# EAGLE schematic WDT (EAGLE 8.2.2)
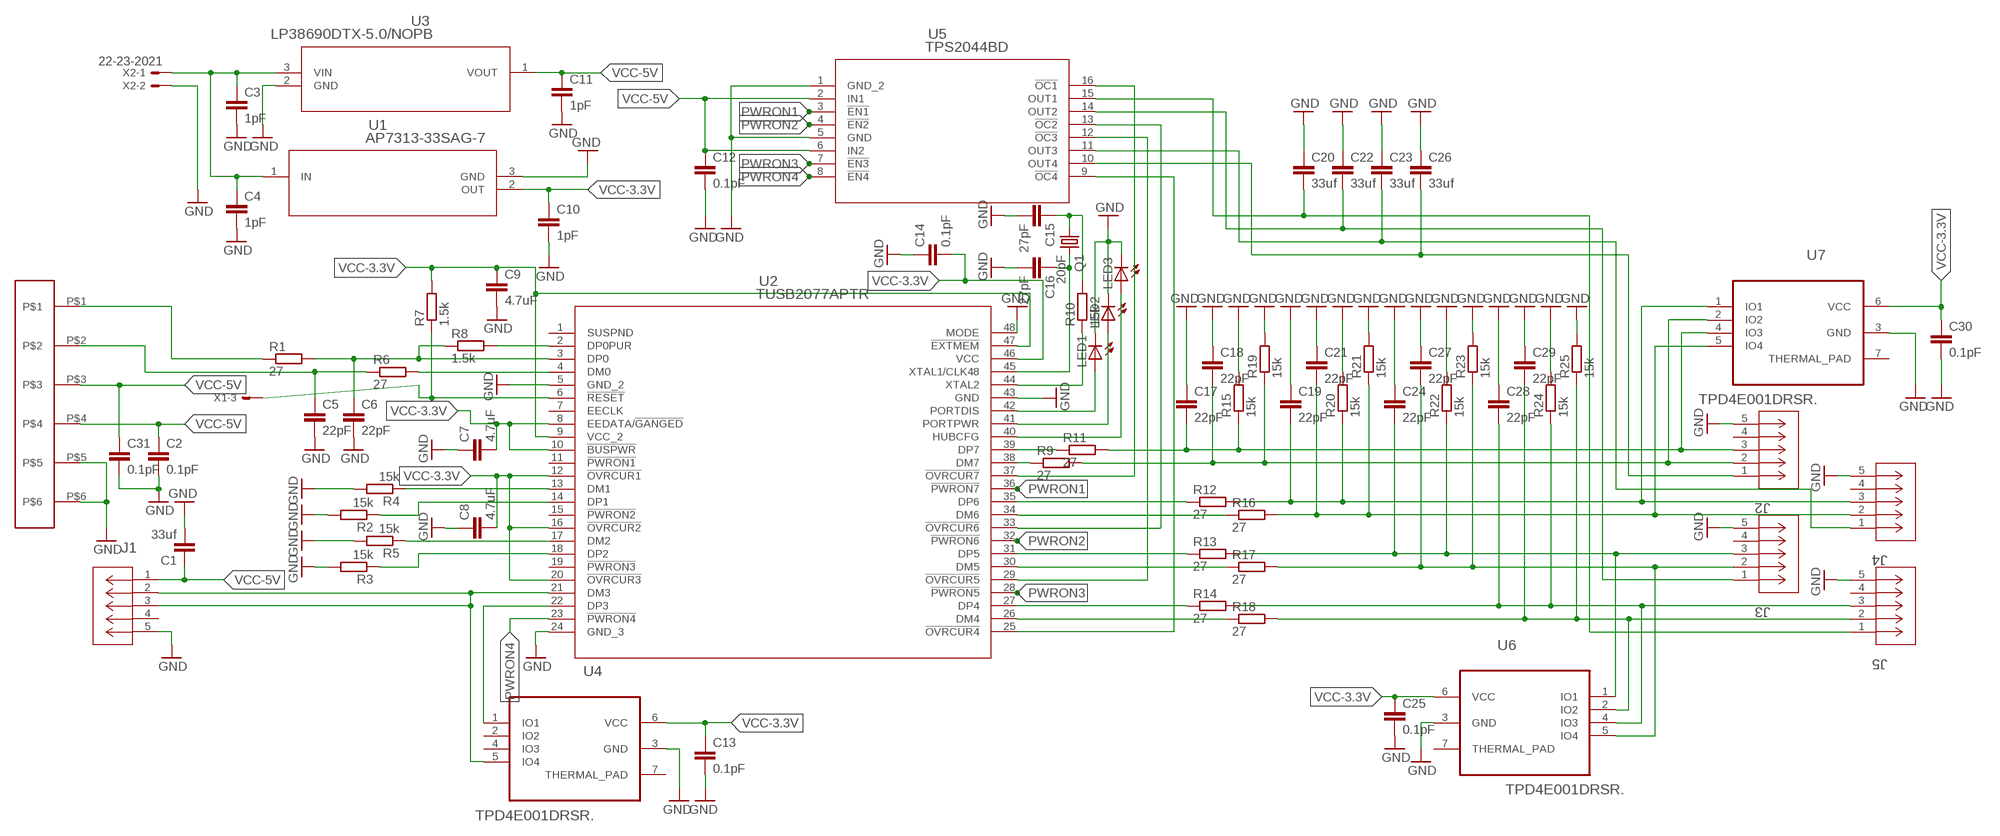
[diagram p0: schematic, sheet 1]

## Parts
C1  33uf  C  [C0805]
C2  0.1pF  C  [C0805]
C3  1pF  C  [C0805]
C4  1pF  C  [C0805]
C5  22pF  C  [C0805]
C6  22pF  C  [C0805]
C7  4.7uF  C  [C0805]
C8  4.7uF  C  [C0805]
C9  4.7uF  C  [C0805]
C10  1pF  C  [C0805]
C11  1pF  C  [C0805]
C12  0.1pF  C  [C0805]
C13  0.1pF  C  [C0805]
C14  0.1pF  C  [C0805]
C15  27pF  C  [C0805]
C16  27pF  C  [C0805]
C17  22pF  C  [C0805]
C18  22pF  C  [C0805]
C19  22pF  C  [C0805]
C20  33uf  C  [C0805]
C21  22pF  C  [C0805]
C22  33uf  C  [C0805]
C23  33uf  C  [C0805]
C24  22pF  C  [C0805]
C25  0.1pF  C  [C0805]
C26  33uf  C  [C0805]
C27  22pF  C  [C0805]
C28  22pF  C  [C0805]
C29  22pF  C  [C0805]
C30  0.1pF  C  [C0805]
C31  0.1pF  C  [C0805]
J1  1981568-1  [CONN_1981568-1]
J2  1981568-1  [CONN_1981568-1]
J3  1981568-1  [CONN_1981568-1]
J4  1981568-1  [CONN_1981568-1]
J5  1981568-1  [CONN_1981568-1]
LED1  LED_E  [LED_1206]
LED2  LED_E  [LED_1206]
LED3  LED_E  [LED_1206]
Q1  20pF  CRYSTALCTS406  [CTS406]
R1  27  R  [R0805]
R2  15k  R  [R0805]
R3  15k  R  [R0805]
R4  15k  R  [R0805]
R5  15k  R  [R0805]
R6  27  R  [R0805]
R7  1.5k  R  [R0805]
R8  1.5k  R  [R0805]
R9  27  R  [R0805]
R10  15k  R  [R0805]
R11  27  R  [R0805]
R12  27  R  [R0805]
R13  27  R  [R0805]
R14  27  R  [R0805]
R15  15k  R  [R0805]
R16  27  R  [R0805]
R17  27  R  [R0805]
R18  27  R  [R0805]
R19  15k  R  [R0805]
R20  15k  R  [R0805]
R21  15k  R  [R0805]
R22  15k  R  [R0805]
R23  15k  R  [R0805]
R24  15k  R  [R0805]
R25  15k  R  [R0805]
U1  AP7313-33SAG-7  [SOT-23]
U2  TUSB2077APTR  [PT48]
U3  LP38690DTX-5.0/NOPB  [TD03B]
U4  TPD4E001DRSR.  [SON95P315X315X80-7N]
U5  TPS2044BD  [D16]
U6  TPD4E001DRSR.  [SON95P315X315X80-7N]
U7  TPD4E001DRSR.  [SON95P315X315X80-7N]
U$1  HEADER-6PIN-50MIL  [PIN-4-1.27MMPITCH]
X1  22-23-2051  [22-23-2051]
X2  22-23-2021  [22-23-2021]

## Nets
GND: C1.2 C2.2 C3.2 C4.2 C5.2 C6.2 C7.1 C8.1 C9.2 C10.2 C11.2 C12.2 C13.2 C14.1 C15.2 C16.2 C17.1 C18.1 C19.1 C20.1 C21.1 C22.1 C23.1 C24.1 C25.2 C26.1 C27.1 C28.1 C29.1 C30.2 C31.2 J1.5 J2.5 J3.5 J4.5 J5.5 LED1.C LED2.C LED3.C R2.2 R3.2 R4.2 R5.2 R15.2 R19.2 R20.2 R21.2 R22.2 R23.2 R24.2 R25.2 U1.3(GND) U2.5(GND_2) U2.24(GND_3) U2.43(GND) U2.48(MODE) U3.2(GND) U4.3(GND) U5.1(GND_2) U5.5(GND) U6.3(GND) U7.3(GND) U$1.P$5 U$1.P$6 X2.2
N27: U2.37(!OVRCUR7) U5.16(!OC1)
N$1: C3.1 C4.1 U1.1(IN) U3.3(VIN) X2.1
N$2: R7.1 U2.6(!RESET) X1.3
N$3: R8.2 U2.2(DP0PUR)
N$4: R10.1 U2.44(XTAL2)
N$5: R5.1 U2.17(DM2)
N$6: C24.2 J3.3 R13.2 R22.1 U6.1(IO1)
N$7: C27.2 J3.2 R17.2 R23.1 U6.5(IO4)
N$8: C22.2 J3.1 U5.14(OUT2)
N$9: LED1.A U2.42(PORTDIS)
N$10: C17.2 J2.3 R11.2 R15.1 U7.4(IO3)
N$11: C18.2 J2.2 R9.2 R19.1 U7.2(IO2)
N$12: C19.2 J4.3 R12.2 R20.1 U7.1(IO1)
N$13: C21.2 J4.2 R16.2 R21.1 U7.5(IO4)
N$14: C28.2 J5.3 R14.2 R24.1 U6.4(IO3)
N$15: C29.2 J5.2 R18.2 R25.1 U6.2(IO2)
N$16: J1.2 J1.3 U2.21(DM3) U4.5(IO4)
N$17: U2.22(DP3) U4.1(IO1)
N$18: R14.1 U2.27(DP4)
N$19: R9.1 U2.38(DM7)
N$20: R11.1 U2.39(DP7)
N$21: C6.1 R1.2 R8.1 U2.3(DP0)
N$22: C5.1 R6.1 U$1.P$2
N$23: C26.2 J2.1 U5.10(OUT4)
N$24: C23.2 J4.1 U5.11(OUT3)
N$25: C20.2 J5.1 U5.15(OUT1)
N$26: R4.1 U2.13(DM1)
N$27: R3.1 U2.18(DP2)
N$28: U2.29(!OVRCUR5) U5.12(!OC3)
N$29: R1.1 U$1.P$1
N$30: U2.33(!OVRCUR6) U5.13(!OC2)
N$31: R6.2 U2.4(DM0)
N$32: R2.1 U2.14(DP1)
N$33: R12.1 U2.35(DP6)
N$34: R17.1 U2.30(DM5)
N$35: U2.25(!OVRCUR4) U5.9(!OC4)
N$36: R13.1 U2.31(DP5)
N$37: R18.1 U2.26(DM4)
N$38: R16.1 U2.34(DM6)
N$39: LED2.A U2.41(PORTPWR)
N$40: LED3.A U2.40(HUBCFG)
N$41: C16.1 Q1.3 U2.45(XTAL1/CLK48)
N$42: C15.1 Q1.1 R10.2
PWRON1: U2.36(!PWRON7) U5.3(!EN1)
PWRON2: U2.32(!PWRON6) U5.4(!EN2)
PWRON3: U2.28(!PWRON5) U5.7(!EN3)
PWRON4: U2.23(!PWRON4) U5.8(!EN4)
VCC-3.3V: C7.2 C8.2 C9.1 C10.1 C13.1 C14.2 C25.1 C30.1 R7.2 U1.2(OUT) U2.8(EEDATA/!GANGED) U2.9(VCC_2) U2.10(!BUSPWR) U2.12(!OVRCUR1) U2.16(!OVRCUR2) U2.20(!OVRCUR3) U2.46(VCC) U2.47(!EXTMEM) U4.6(VCC) U6.6(VCC) U7.6(VCC)
VCC-5V: C1.1 C2.1 C11.1 C12.1 C31.1 J1.1 U3.1(VOUT) U5.2(IN1) U5.6(IN2) U$1.P$3 U$1.P$4
Unconnected: J1.4 J2.4 J3.4 J4.4 J5.4 U2.1(SUSPND) U2.7(EECLK) U2.11(!PWRON1) U2.15(!PWRON2) U2.19(!PWRON3) U4.2(IO2) U4.4(IO3) U4.7(THERMAL_PAD) U6.7(THERMAL_PAD) U7.7(THERMAL_PAD) X1.1 X1.2 X1.4 X1.5

## Library data of the parts
C1-C31 = eagle-ltspice:C: CAPACITOR, European symbol; SPICEMODEL: NONE; SPICEPREFIX: C
J1-J5 = USB-microB:1981568-1; MANUFACTURER_PART_NUMBER: 19815681; VENDOR: Tyco Electronics
LED1-LED3 = eagle-ltspice:LED_E: LED Source: http://www.osram.convergy.de Source: www.luxeon.com Source: www.kingbright.com; SPICEMODEL: NONE; SPICEPREFIX: D; SPICETYPE: diode
Q1 = crystal:CRYSTAL: CRYSTAL; OC_FARNELL: unknown; OC_NEWARK: unknown
R1-R25 = eagle-ltspice:R: RESISTOR, European symbol; SPICEMODEL: NONE; SPICEPREFIX: R
U1 = AP7313-33SAG(6V-3.3V):AP7313-33SAG-7; MANUFACTURER_PART_NUMBER: AP731333SAG7; VENDOR: Diodes Inc
U2 = TUSB2077A-7-PortHubUSB:TUSB2077APTR; MANUFACTURER_PART_NUMBER: TUSB2077APTR; VENDOR: Texas Instruments
U3 = LP38690(5V-regulator):LP38690DTX-5.0/NOPB; MANUFACTURER_PART_NUMBER: LP38690DTX5.0NOPB; VENDOR: Texas Instruments
U4 U6 U7 = TPD4E001DRSR.:TPD4E001DRSR.: 4-CHANNEL ESD PROTECTION ARRAY WITH 1.5-pF IO CAPACITANCE; AVAILABILITY: Good; DESCRIPTION: Low-Capacitance 4-Channel %2B/-15-kV ESD Protection Array for High-Speed Data Interfaces 6-SON -40 to 85; MF: Texas Instruments; MP: TPD4E001DRSR; PACKAGE: WSON-6 Texas Instruments; PRICE: 0.33 USD
U5 = TPS2044(Power-Distribution Switches):TPS2044BD; MANUFACTURER_PART_NUMBER: TPS2044BD; VENDOR: Texas Instruments
U$1 = HEADER-6:HEADER-6PIN-50MIL
X1 = con-molex:22-23-2051: .100" (2.54mm) Center Header - 5 Pin; MF: MOLEX; MPN: 22-23-2051; OC_FARNELL: 1462952; OC_NEWARK: 38C9178
X2 = con-molex:22-23-2021: .100" (2.54mm) Center Header - 2 Pin; MF: MOLEX; MPN: 22-23-2021; OC_FARNELL: 1462926; OC_NEWARK: 25C3832

## Net classes
0 default: width 0.305 mm, drill 0.508 mm, clearance 0.254 mm
1 power: width 0.762 mm, drill 0.508 mm, clearance 0.254 mm
2 usbsignal: width 0.305 mm, drill 0.508 mm, clearance 0.508 mm